# EasyEDA Pro project ProDoc_promicro_e22P_Tomas_2026-05-28.epro

# Schematic promicro_e22P_Tomas
Board Name: promicro_e22P_Tomas; Create Date: 2026-05-04; Page Name: Sheet_1; Project Name: promicro_e22P_30_2026-04-24_20-44-31; Schematic Name: promicro_e22P_Tomas; Update Date: 2026-05-04; Add into BOM: yes; Company: CNCnet; Convert to PCB: yes; Date: 2026-04-01; Draw By: Radek Vicek; REV: 1.0; Sheet: 1/1; spicePre: .
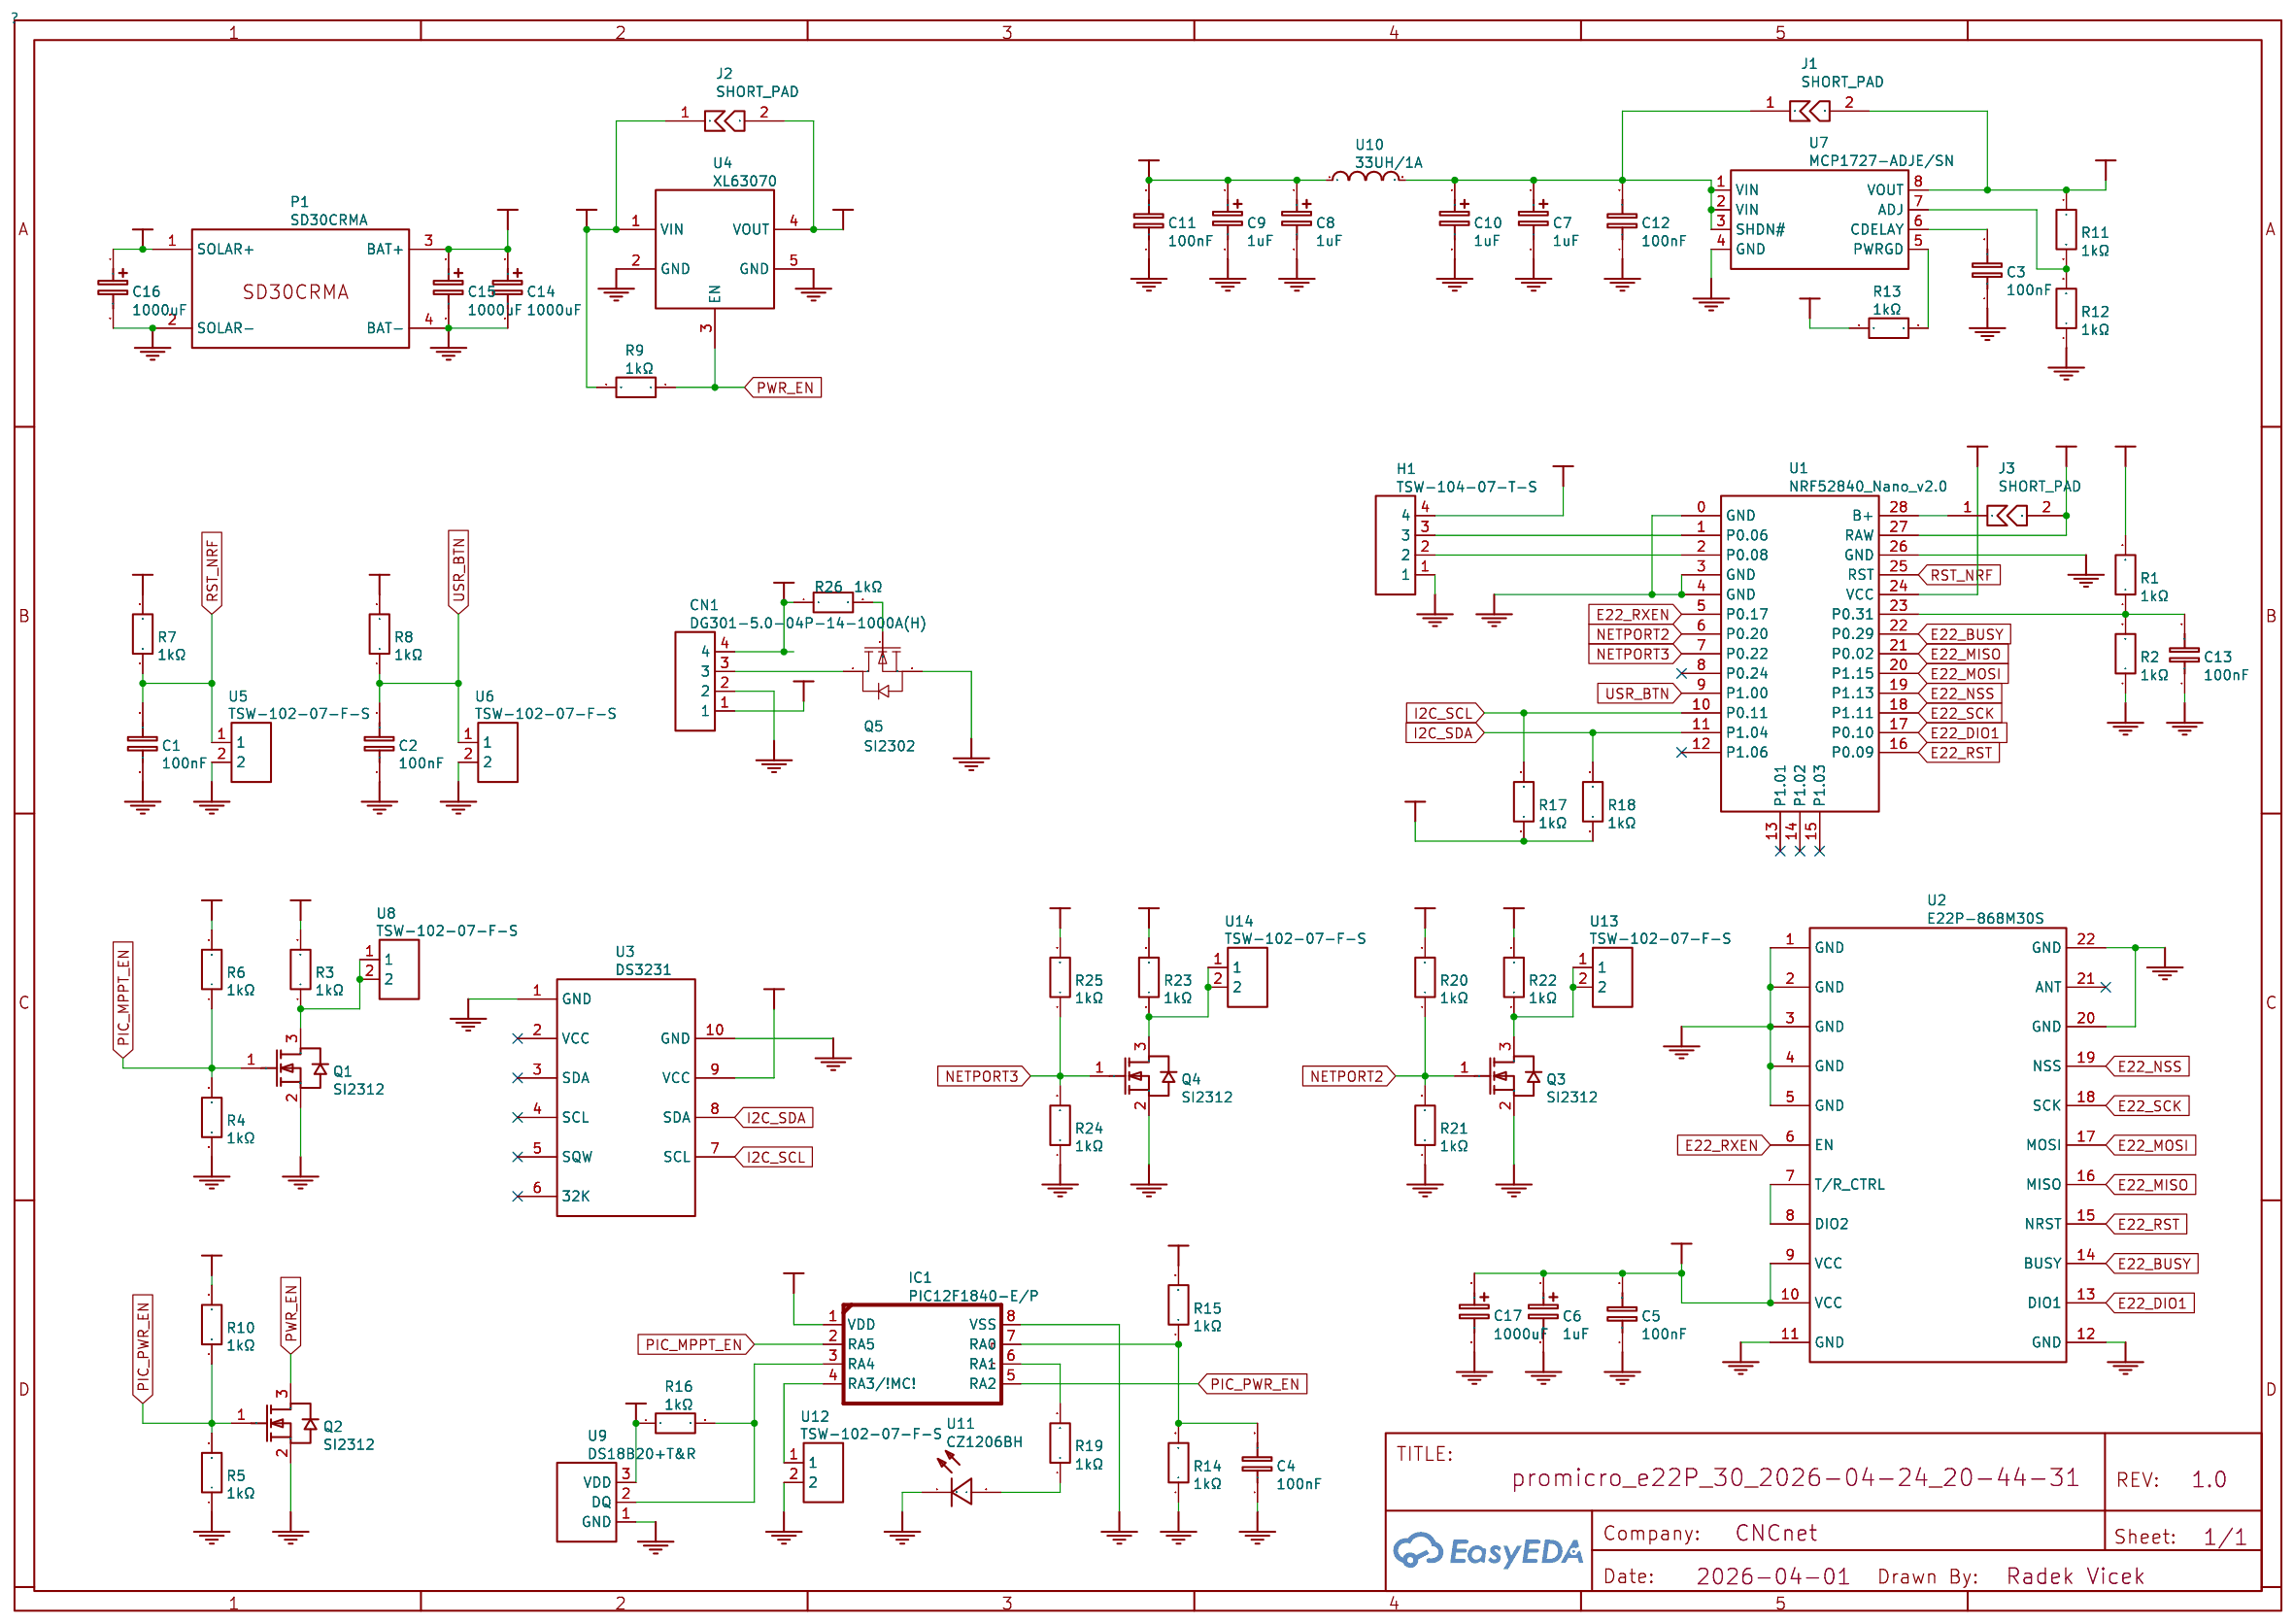
[diagram p0: schematic sheet]

## Parts
C1  100nF  [C1206]
C2  100nF  [C1206]
C3  100nF  [C1206]
C4  100nF  [C1206]
C5  100nF  [C1206]
C6  1uF  [CAP-SMD_L3.5-W2.8-R-RD]
C7  1uF  [CAP-SMD_L3.5-W2.8-R-RD]
C8  1uF  [CAP-SMD_L3.5-W2.8-R-RD]
C9  1uF  [CAP-SMD_L3.5-W2.8-R-RD]
C10  1uF  [CAP-SMD_L3.5-W2.8-R-RD]
C11  100nF  [C1206]
C12  100nF  [C1206]
C13  100nF  [C1206]
C14  1000uF  [CAP-D10.0×F5.0]
C15  1000uF  [CAP-D10.0×F5.0]
C16  1000uF  [CAP-D10.0×F5.0]
C17  1000uF  [CAP-D10.0×F5.0]
CN1  DG301-5.0-04P-14-1000A(H)  [CONN-TH_DEGSON_DG301-5.0-04P]
H1  TSW-104-07-T-S  [HDR-TH_4P-P2.54-V-M]
IC1  PIC12F1840-E/P  [DIL8-P]
J1  SHORT_PAD  [SHORT_PAD]
J2  SHORT_PAD  [SHORT_PAD]
J3  SHORT_PAD  [SHORT_PAD]
P1  SD30CRMA  [SD30CRMA]
Q1  SI2312  [SOT-23-3_L2.9-W1.3-P1.90-LS2.4-BR]
Q2  SI2312  [SOT-23-3_L2.9-W1.3-P1.90-LS2.4-BR]
Q3  SI2312  [SOT-23-3_L2.9-W1.3-P1.90-LS2.4-BR]
Q4  SI2312  [SOT-23-3_L2.9-W1.3-P1.90-LS2.4-BR]
Q5  SI2302  [SOT-23-3_L2.9-W1.3-P1.90-LS2.4-BR]
R1  1kΩ  [R1206]
R2  1kΩ  [R1206]
R3  1kΩ  [R1206]
R4  1kΩ  [R1206]
R5  1kΩ  [R1206]
R6  1kΩ  [R1206]
R7  1kΩ  [R1206]
R8  1kΩ  [R1206]
R9  1kΩ  [R1206]
R10  1kΩ  [R1206]
R11  1kΩ  [R1206]
R12  1kΩ  [R1206]
R13  1kΩ  [R1206]
R14  1kΩ  [R1206]
R15  1kΩ  [R1206]
R16  1kΩ  [R1206]
R17  1kΩ  [R1206]
R18  1kΩ  [R1206]
R19  1kΩ  [R1206]
R20  1kΩ  [R1206]
R21  1kΩ  [R1206]
R22  1kΩ  [R1206]
R23  1kΩ  [R1206]
R24  1kΩ  [R1206]
R25  1kΩ  [R1206]
R26  1kΩ  [R1206]
U1  NRF52840_Nano_v2.0  [NRF52840_NANO_V2,0]
U2  E22P-868M30S  [E22P-868M30S]
U3  DS3231  [DS3231]
U4  XL63070  [XL63070]
U5  TSW-102-07-F-S  [HDR-TH_2P-P2.54-V-M-3]
U6  TSW-102-07-F-S  [HDR-TH_2P-P2.54-V-M-3]
U7  MCP1727-ADJE/SN  [SOIC-8_L4.9-W3.9-P1.27-LS6.0-BL]
U8  TSW-102-07-F-S  [HDR-TH_2P-P2.54-V-M-3]
U9  DS18B20+T&R  [TO-92-3_L4.9-W3.7-P2.54-L]
U10  33UH/1A  [IND-TH_BD10.0-P5.00-D0.6]
U11  CZ1206BH  [LED-SMD_CZ1206BH]
U12  TSW-102-07-F-S  [HDR-TH_2P-P2.54-V-M-3]
U13  TSW-102-07-F-S  [HDR-TH_2P-P2.54-V-M-3]
U14  TSW-102-07-F-S  [HDR-TH_2P-P2.54-V-M-3]

## Library data of the parts
C1-C5 C11-C13 = CT41G-0805-2X1-50V-0.1uF-K(N): Capacitance:100nF Tolerance:±10% Tolerance:±10% Voltage Rating:50V Temperature Coefficient:-; LCSC Part Name: 100nF ±10% 50V; Supplier Part: C126469; Manufacturer: TORCH(火炬); Supplier Footprint: 0805; JLCPCB Part Class: Extended Part; Datasheet: https://item.szlcsc.com/datasheet/CT41G-0805-2X1-50V-0.1uF-K(N)/137749.html; Supplier: LCSC; Tolerance: ±10%; Voltage Rating: 50V
C6-C10 = TAJB105K035RNJ: Capacitance: Tolerance:±10% Tolerance:±10% Rated Voltage: Equivalent Series Resistance(ESR):6.5Ω@100kHz Operating Temperature:-55℃~+125℃ Operating Temperature:-55℃~+125℃; LCSC Part Name: 1uF ±10% 35V; Supplier Part: C7192; Manufacturer: Kyocera AVX; Supplier Footprint: CASE-B-3528-21(mm); JLCPCB Part Class: Extended Part; Datasheet: https://atta.szlcsc.com/upload/public/pdf/source/20160107/1457707750344.pdf; Supplier: LCSC; Tolerance: ±10%; Equivalent Series Resistance(ESR): 6.5Ω@100kHz; Operating Temperature: -55℃~+125℃
C14-C17 = PB25V1000M8X17: Capacitance:1000uF Tolerance:±20% Tolerance:±20% Voltage Rating:25V Ripple Current:4.5A@100kHz Equivalent Series Resistance(ESR):16mΩ@100kHz Type:Polymer Pin Spacing:3.5mm Diameter:8mm Height - Seated (Max):17mm Lifetime:5000hrs@105℃ Operating Temperature; LCSC Part Name: 1000uF ±20% 25V; Supplier Part: C51934175; Manufacturer: JIERR(捷而瑞); Supplier Footprint: 插件,D8xL17mm; JLCPCB Part Class: Extended Part; Datasheet: https://item.szlcsc.com/datasheet/PB25V1000M8X17/54649587.html; Supplier: LCSC; Tolerance: ±20%; Voltage Rating: 25V; Ripple Current: 4.5A@100kHz; Equivalent Series Resistance(ESR): 16mΩ@100kHz; Type: Polymer; Pin Spacing: 3.5mm; Diameter: 8mm; Height - Seated (Max): 17mm; Lifetime: 5000hrs@105℃; Operating Temperature: -55℃~+105℃
CN1 = DG301-5.0-04P-14-1000A(H): Supplier: LCSC; Supplier Part: C3037697; Manufacturer: DEGSON(高正/高松); JLCPCB Part Class: Extended Part; Contributor: lcsc; spicePre: C
H1 = TSW-104-07-T-S: Supplier: LCSC; Supplier Part: C7365925; Manufacturer: SAMTEC; JLCPCB Part Class: Extended Part; Contributor: lcsc; spicePre: H
IC1 = PIC12F1840-E/P: CPU Core:PIC CPU Maximum Speed:32MHz Core Size:8 Bit Program Storage Size:7KB Program Memory Type:FLASH RAM Size:256Byte EEPROM:256Byte Number of I/O:5 ADC (Bit):10bit DAC (Bit):5bit Oscillator Type:Built-in Voltage - Supply:2.3V~5.5V Voltage - Supply:2.3; LCSC Part Name: 采用XLP技术的8引脚闪存微控制器; Supplier Part: C640529; Manufacturer: MICROCHIP(美国微芯); Supplier Footprint: PDIP-8; JLCPCB Part Class: Extended Part; Datasheet: https://item.szlcsc.com/datasheet/PIC12F1840-E%252FP/670326.html; Supplier: LCSC; CPU Core: PIC; CPU Maximum Speed: 32MHz; Core Size: 8 Bit; Program Storage Size: 7KB; Program Memory Type: FLASH; RAM Size: 256Byte; EEPROM: 256Byte; Number of I/O: 5; ADC (Bit): 10bit; DAC (Bit): 5bit; Oscillator Type: Built-in; Voltage - Supply: 2.3V~5.5V; Operating Temperature: -40℃~+125℃
J1-J3 = SHORT_PAD: _: 3
P1 = SD30CRMA: Contributor: mrilic66; spicePre: P
Q1-Q4 = SI2312: Supplier: LCSC; Supplier Part: C351405; Manufacturer: PUOLOP(迪浦); JLCPCB Part Class: Extended Part; Contributor: LCSC; spicePre: Q
Q5 = SI2302_C20628873: Number:1 N-Channel Drain to Source Voltage:20V Current - Continuous Drain(Id):3.3A RDS(on):75mΩ@2.5V Pd - Power Dissipation:1W Gate Threshold Voltage (Vgs(th)):1.5V@250uA Type:N-Channel; LCSC Part Name: 1个N沟道 耐压:20V 电流:3.3A; Supplier Part: C20628873; Manufacturer: FOSAN(富捷/富信); Supplier Footprint: SOT-23; JLCPCB Part Class: Extended Part; Datasheet: https://item.szlcsc.com/datasheet/SI2302/22043121.html; Supplier: LCSC; Number: 1 N-Channel; Drain to Source Voltage: 20V; Current - Continuous Drain(Id): 3.3A; RDS(on): 75mΩ@2.5V; Pd - Power Dissipation: 1W; Gate Threshold Voltage (Vgs(th)): 1.5V@250uA; Type: N-Channel
R1-R26 = FRC0805J102 TS: Type:Thick Film Resistor Resistance:1kΩ Tolerance:±5% Tolerance:±5% Power(Watts):125mW Voltage-Supply(Max):150V Temperature Coefficient:±100ppm/℃ Temperature Coefficient:±100ppm/℃ Operating Temperature:-55℃~+155℃ Operating Temperature:-55℃~+155℃; LCSC Part Name: 1kΩ ±5% 125mW 厚膜电阻; Supplier Part: C2907295; Manufacturer: FOJAN(富捷); Supplier Footprint: 0805; JLCPCB Part Class: Extended Part; Supplier: LCSC; Type: Thick Film Resistor; Tolerance: ±5%; Power(Watts): 125mW; Voltage-Supply(Max): 150V; Temperature Coefficient: ±100ppm/℃; Operating Temperature: -55℃~+155℃
U1 = NRF52840_Nano_v2.0: Contributor: eugeniomercol; spicePre: U
U2 = E22P-868M30S: Supplier Part: C51912689; Manufacturer: EBYTE(亿佰特); Supplier Footprint: SMD,38.5x24mm; JLCPCB Part Class: Extended Part; Supplier: LCSC
U3 = DS3231: Manufacturer: IIOTSME; Supplier: IIOTSME; Contributor: mazran.iiotsme; spicePre: U
U4 = XL63070: Contributor: willyjestrabek; spicePre: U
U5 U6 U8 U12-U14 = TSW-102-07-F-S: Supplier: LCSC; Supplier Part: C3331037; Manufacturer: SAMTEC; JLCPCB Part Class: Extended Part; Contributor: lcsc; spicePre: U
U7 = MCP1727-ADJE/SN: Supplier: LCSC; Supplier Part: C635937; Manufacturer: MICROCHIP(美国微芯); JLCPCB Part Class: Extended Part; Contributor: LCSC; spicePre: U
U9 = DS18B20+T&R: Supplier: LCSC; Supplier Part: C880672; Manufacturer: ADI(亚德诺)/MAXIM(美信); JLCPCB Part Class: Extended Part; Contributor: LCSC; spicePre: U; spiceSymbolName: DS18B20+T&amp;R
U10 = 33UH/1A: Supplier: LCSC; Supplier Part: C9900019827; Manufacturer: null; Manufacturer Part: 33uH/1A; JLCPCB Part Class: Extended Part; Contributor: lcsc; spicePre: U
U11 = CZ1206BH: Supplier: LCSC; Supplier Part: C9900198175; Manufacturer: null; JLCPCB Part Class: Extended Part; Contributor: lcsc; spicePre: U

## Nets
+3V3: H1.4 R3.2 R6.2 R7.2 R8.2 R10.2 R17.1 R18.1 R20.2 R22.2 R23.2 R25.2 U1.24(VCC) U3.9(VCC)
+5V: C8.1 C9.1 C11.2 J2.2 U4.4(VOUT) U10.1
GND: C1.1 C2.1 C3.1 C4.1 C5.1 C6.2 C7.2 C8.2 C9.2 C10.2 C11.1 C12.1 C13.1 C14.2 C15.2 C16.2 C17.2 CN1.2 H1.1 IC1.8(VSS) P1.2(SOLAR-) P1.4(BAT-) Q1.2(S) Q2.2(S) Q3.2(S) Q4.2(S) Q5.2(S) R2.1 R4.1 R5.1 R12.1 R14.1 R21.1 R24.1 U1.0(GND) U1.3(GND) U1.4(GND) U1.26(GND) U2.1(GND) U2.2(GND) U2.3(GND) U2.4(GND) U2.5(GND) U2.11(GND) U2.12(GND) U2.20(GND) U2.22(GND) U3.1(GND) U3.10(GND) U4.2(GND) U4.5(GND) U5.2 U6.2 U7.4(GND) U9.1(GND) U11.1(C) U12.2
VBAT: C14.1 C15.1 CN1.4 IC1.1(VDD) J2.1 P1.3(BAT+) R1.2 R9.2 R15.2 R16.1 R26.1 U4.1(VIN) U9.3(VDD)
E22_BUSY: U1.22(P0.29) U2.14(BUSY)
E22_DIO1: U1.17(P0.10) U2.13(DIO1)
E22_MISO: U1.21(P0.02) U2.16(MISO)
E22_MOSI: U1.20(P1.15) U2.17(MOSI)
E22_NSS: U1.19(P1.13) U2.19(NSS)
E22_RST: U1.16(P0.09) U2.15(NRST)
E22_RXEN: U1.5(P0.17) U2.6(EN)
E22_SCK: U1.18(P1.11) U2.18(SCK)
I2C_SCL: R17.2 U1.10(P0.11) U3.7(SCL)
I2C_SDA: R18.2 U1.11(P1.04) U3.8(SDA)
NETPORT2: Q3.1(G) R20.1 R21.2 U1.6(P0.20)
NETPORT3: Q4.1(G) R24.2 R25.1 U1.7(P0.22)
PIC_MPPT_EN: IC1.2(RA5) Q1.1(G) R4.2 R6.1
PIC_PWR_EN: IC1.5(RA2) Q2.1(G) R5.2 R10.1
PWR_EN: Q2.3(D) R9.1 U4.3(EN)
RST_NRF: C1.2 R7.1 U1.25(RST) U5.1
USR_BTN: C2.2 R8.1 U1.9(P1.00) U6.1
VRAW: C5.2 C6.1 C17.1 J1.2 J3.2 R11.1 R13.2 U1.27(RAW) U2.9(VCC) U2.10(VCC) U7.8(VOUT)
VSOL: C16.1 CN1.1 P1.1(SOLAR+)
$1N10: U2.7(T/R CTRL) U2.8(DIO2)
$1N12: C13.2 R1.1 R2.2 U1.23(P0.31)
$1N32: Q1.3(D) R3.1 U8.1 U8.2
$1N33: R13.1 U7.5(PWRGD)
$1N35: C3.2 U7.6(CDELAY)
$1N37: R11.2 R12.2 U7.7(ADJ)
$1N43: IC1.3(RA4) R16.2 U9.2(DQ)
$1N45: C4.2 IC1.7(RA0) R14.2 R15.1
$1N53: C7.1 C10.1 C12.2 J1.1 U7.1(VIN) U7.2(VIN) U7.3(SHDN#) U10.2
$1N58: H1.3 U1.1(P0.06)
$1N62: H1.2 U1.2(P0.08)
$1N68: R19.1 U11.2(A)
$1N69: IC1.6(RA1) R19.2
$1N72: IC1.4(RA3/!MC!) U12.1
$1N75: Q3.3(D) R22.1 U13.1 U13.2
$1N84: Q4.3(D) R23.1 U14.1 U14.2
$1N86: J3.1 U1.28(B+)
$1N3345: CN1.3 Q5.3(D)
$1N3704: Q5.1(G) R26.2

Not connected (* = marked no-connect by the designer): U1 8(P0.24)* 12(P1.06)* 13(P1.01)* 14(P1.02)* 15(P1.03)*; U2 21(ANT)*; U3 2(VCC)* 3(SDA)* 4(SCL)* 5(SQW)* 6(32K)*

# Board PCB_promicro_e22P_30_Tomas
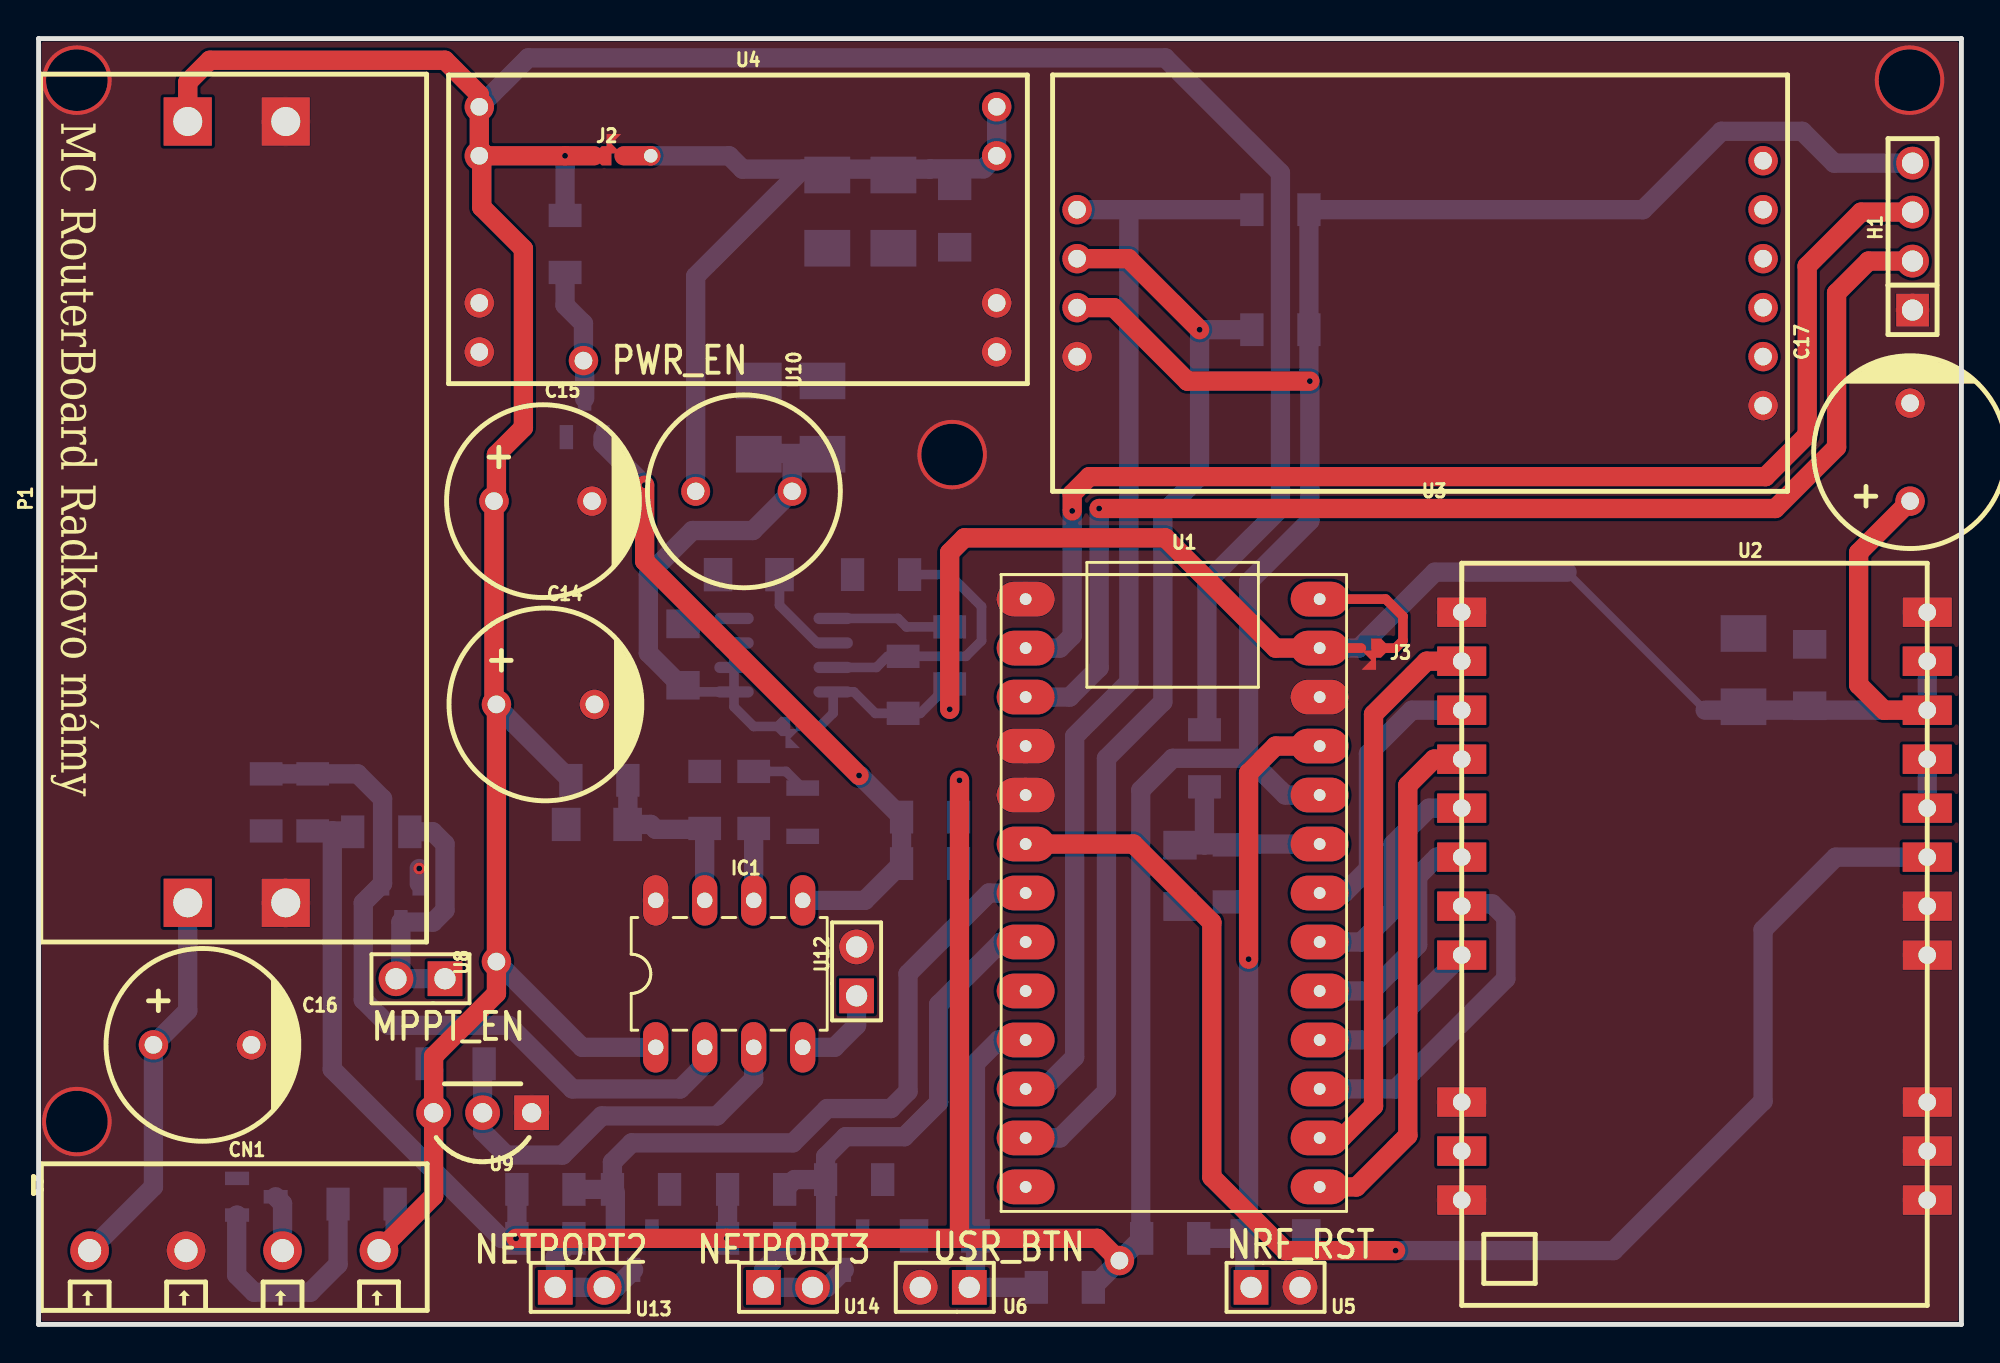
[diagram p1: board, top side]
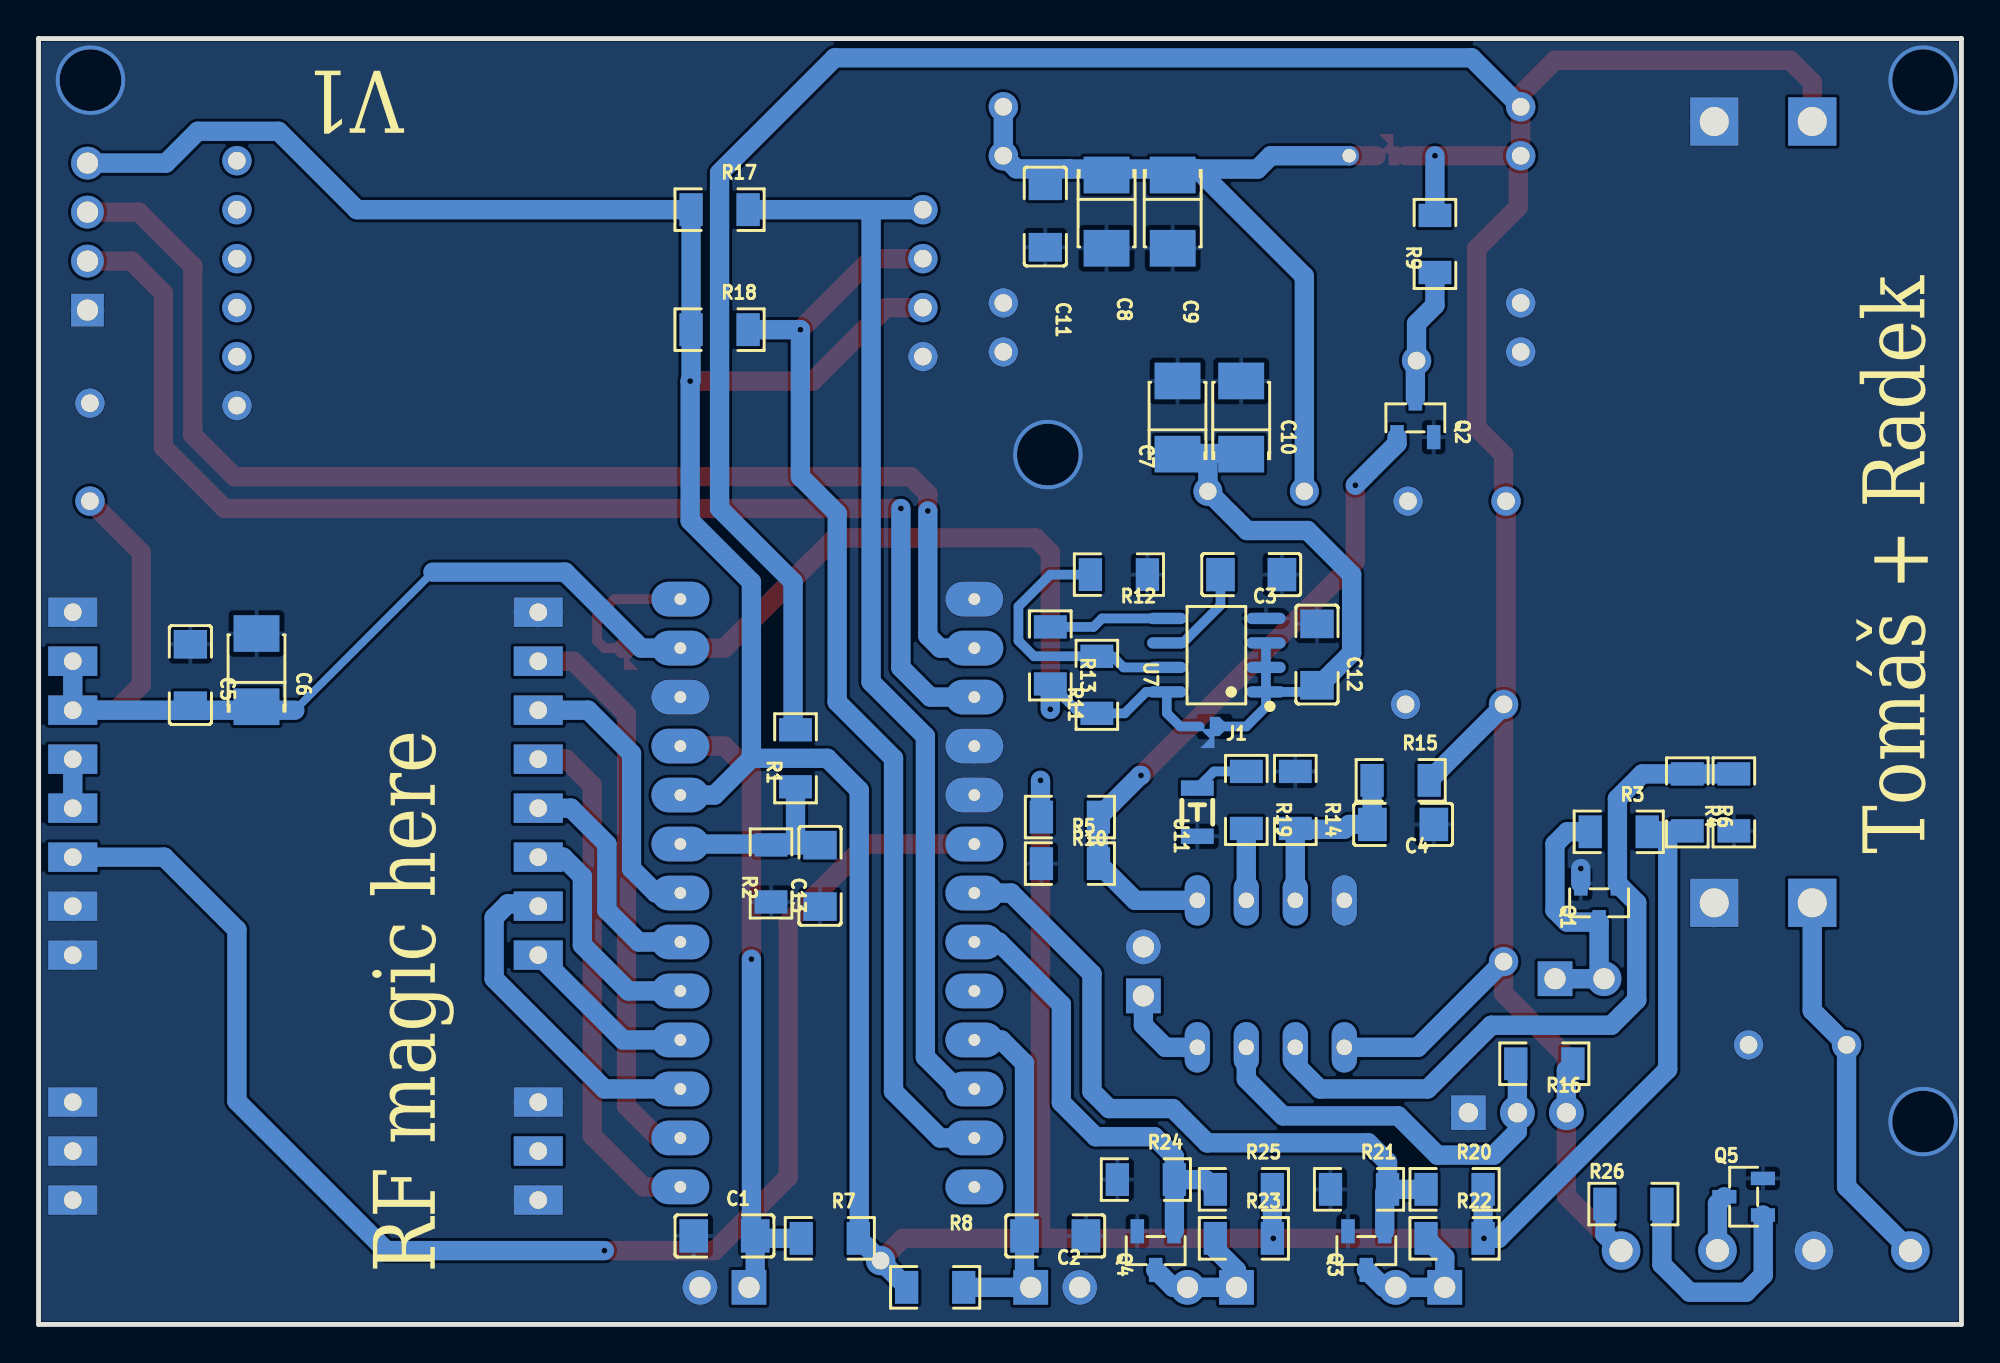
[diagram p2: board, bottom side, seen from below]

Outline 99.67 x 66.67 mm; copper layers: Top Layer, Bottom Layer. Coordinates in mm from the lower left corner of the outline.
Outline path: 0,66.67 99.67,66.67 99.67,0 0,0 0,66.67
Stack: Top Layer 0.035mm / Dielectric1 1.51mm FR4 er 4.5 / Bottom Layer 0.035mm

## Design rules (mm)
spacing Default (default): track to track 0.152, other pairs 0 to 0.152
track width Default (default): min 0.254, default 0.254, max 25.4
differential pair differentialPair (default): width min 0.127, default 0.254, max 2.54; gap min 0.152, default 0.152
via Default (default): diameter min 0.61, default 0.61, max 100.025; hole min 0.305, default 0.305, max 59.995

## Placement (name value [footprint] x y rotation side)
C1  100nF  [C1206]  64.12 4.59 180 bottom
C2  100nF  [C1206]  46.98 4.59 0 bottom
C3  100nF  [C1206]  36.82 38.88 0 bottom
C4  100nF  [C1206]  28.94 25.93 0 bottom
C5  100nF  [C1206]  91.81 33.67 270 bottom
C6  1uF  [CAP-SMD_L3.5-W2.8-R-RD]  88.38 33.93 270 bottom
C7  1uF  [CAP-SMD_L3.5-W2.8-R-RD]  40.64 47.02 270 bottom
C8  1uF  [CAP-SMD_L3.5-W2.8-R-RD]  44.31 57.7 90 bottom
C9  1uF  [CAP-SMD_L3.5-W2.8-R-RD]  40.88 57.7 90 bottom
C10  1uF  [CAP-SMD_L3.5-W2.8-R-RD]  37.33 47.02 270 bottom
C11  100nF  [C1206]  47.49 57.45 90 bottom
C12  100nF  [C1206]  33.41 34.73 270 bottom
C13  100nF  [C1206]  59.17 23.26 90 bottom
C14  1000uF  [CAP-D10.0×F5.0]  26.27 32.15 0 top
C15  1000uF  [CAP-D10.0×F5.0]  26.15 42.69 0 top
C16  1000uF  [CAP-D10.0×F5.0]  8.49 14.5 0 top
C17  1000uF  [CAP-D10.0×F5.0]  97.01 45.23 90 top
CN1  DG301-5.0-04P-14-1000A(H)  [CONN-TH_DEGSON_DG301-5.0-04P]  10.14 3.83 0 top
H1  TSW-104-07-T-S  [HDR-TH_4P-P2.54-V-M]  97.14 56.41 90 top
IC1  PIC12F1840-E/P  [DIL8-P]  35.8 18.18 0 top
J1  -  [SHORT_PAD]  38.47 31.01 0 bottom
J2  -  [SHORT_PAD]  29.2 60.6 0 top
J3  -  [SHORT_PAD]  69.58 35.07 180 top
NOREF  -  [Pad_e1408]  31.73 60.6 0 top
NOREF#2  -  [Pad_e644]  23.73 18.81 0 top
NOREF#3  -  [Pad_e922]  56.03 3.31 0 top
P1  -  [SD30CRMA]  0.11 19.83 90 top
Q1  SI2312  [SOT-23-3_L2.9-W1.3-P1.90-LS2.4-BR]  18.78 21.86 90 bottom
Q2  SI2312  [SOT-23-3_L2.9-W1.3-P1.90-LS2.4-BR]  28.31 47.01 270 bottom
Q3  SI2312  [SOT-23-3_L2.9-W1.3-P1.90-LS2.4-BR]  30.85 3.83 90 bottom
Q4  SI2312  [SOT-23-3_L2.9-W1.3-P1.90-LS2.4-BR]  41.77 3.83 90 bottom
Q5  SI2302  [SOT-23-3_L2.9-W1.3-P1.90-LS2.4-BR]  11.29 6.62 180 bottom
R1  1kΩ  [R1206]  60.44 29.36 90 bottom
R2  1kΩ  [R1206]  61.71 23.39 90 bottom
R3  1kΩ  [R1206]  17.77 25.55 180 bottom
R4  1kΩ  [R1206]  11.8 27.07 90 bottom
R5  1kΩ  [R1206]  46.21 23.89 180 bottom
R6  1kΩ  [R1206]  14.21 27.07 270 bottom
R7  1kΩ  [R1206]  58.66 4.46 180 bottom
R8  1kΩ  [R1206]  53.2 1.92 0 bottom
R9  1kΩ  [R1206]  27.29 56.03 90 bottom
R10  1kΩ  [R1206]  46.21 26.31 0 bottom
R11  1kΩ  [R1206]  44.82 33.17 90 bottom
R12  1kΩ  [R1206]  43.67 38.88 0 bottom
R13  1kΩ  [R1206]  47.23 34.69 270 bottom
R14  1kΩ  [R1206]  34.53 27.2 270 bottom
R15  1kΩ  [R1206]  29.07 28.21 180 bottom
R16  1kΩ  [R1206]  21.62 13.52 0 bottom
R17  1kΩ  [R1206]  64.37 57.8 180 bottom
R18  1kΩ  [R1206]  64.37 51.58 180 bottom
R19  1kΩ  [R1206]  37.07 27.2 270 bottom
R20  1kΩ  [R1206]  26.27 7 180 bottom
R21  1kΩ  [R1206]  31.23 7 180 bottom
R22  1kΩ  [R1206]  26.27 4.46 180 bottom
R23  1kΩ  [R1206]  37.2 4.46 180 bottom
R24  1kΩ  [R1206]  42.28 7.51 180 bottom
R25  1kΩ  [R1206]  37.2 7 180 bottom
R26  1kΩ  [R1206]  17 6.24 180 bottom
U1  NRF52840_Nano_v2.0  [NRF52840_NANO_V2,0]  50.02 5.86 0 top
U2  -  [E22P-868M30S]  85.84 21.69 0 top
U3  -  [DS3231]  88.12 48.91 180 top
U4  -  [XL63070]  22.84 63.14 0 top
U5  TSW-102-07-F-S  [HDR-TH_2P-P2.54-V-M-3]  64.12 1.92 0 top
U6  TSW-102-07-F-S  [HDR-TH_2P-P2.54-V-M-3]  46.98 1.92 180 top
U7  MCP1727-ADJE/SN  [SOIC-8_L4.9-W3.9-P1.27-LS6.0-BL]  38.62 34.7 90 bottom
U8  TSW-102-07-F-S  [HDR-TH_2P-P2.54-V-M-3]  19.8 17.92 180 top
U9  DS18B20+T&R  [TO-92-3_L4.9-W3.7-P2.54-L]  23.02 10.98 180 top
U10  33UH/1A  [IND-TH_BD10.0-P5.00-D0.6]  36.56 43.2 0 top
U11  CZ1206BH  [LED-SMD_CZ1206BH]  39.61 26.56 90 bottom
U12  TSW-102-07-F-S  [HDR-TH_2P-P2.54-V-M-3]  42.4 18.31 90 top
U13  TSW-102-07-F-S  [HDR-TH_2P-P2.54-V-M-3]  28.05 1.92 0 top
U14  TSW-102-07-F-S  [HDR-TH_2P-P2.54-V-M-3]  38.85 1.92 0 top

## Footprints (pads in the part's own frame, mm; a bottom-side part is the same pattern mirrored in y, then rotated)
C1206
  rect 1.485x1.728 smd: 1(-1.593,0) 2(1.593,0)
CAP-D10.0×F5.0
  round 1.524 hole 0.914: 1(-2.54,0) 2(2.54,0)
CAP-SMD_L3.5-W2.8-R-RD
  rect 1.9x2.376 smd: 1(1.899,0) 2(-1.899,0)
CONN-TH_DEGSON_DG301-5.0-04P
  round 2 hole 1.2: 1(-7.5,0) 2(-2.5,0) 3(2.5,0) 4(7.5,0)
DIL8-P
  oval 1.308x2.616 hole 0.8x0.805: 1(-3.81,-3.81) 2(-1.27,-3.81) 3(1.27,-3.81) 4(3.81,-3.81) 5(3.81,3.81) 6(1.27,3.81) 7(-1.27,3.81) 8(-3.81,3.81)
DS3231
  round 1.524 hole 0.914: 1(-1.27,1.27) 2(-1.27,-1.27) 3(-1.27,-3.81) 4(-1.27,-6.35) 5(-1.27,-8.89) 6(-1.27,-11.43) 7(34.29,-8.89) 8(34.29,-6.35) 9(34.29,-3.81) 10(34.29,-1.27)
E22P-868M30S
  rect 2.54x1.524 hole 0.914: 1(12.065,-15.24) 2(12.065,-12.7) 3(12.065,-10.16) 4(12.065,-2.54) 5(12.065,0) 6(12.065,2.54) 7(12.065,5.08) 8(12.065,7.62) 9(12.065,10.16) 10(12.065,12.7) 11(12.065,15.24) 12(-12.065,15.24) 13(-12.065,12.7) 14(-12.065,10.16) 15(-12.065,7.62) 16(-12.065,5.08) 17(-12.065,2.54) 18(-12.065,0) 19(-12.065,-2.54) 20(-12.065,-10.16) 21(-12.065,-12.7) 22(-12.065,-15.24)
HDR-TH_2P-P2.54-V-M-3
  rect 1.8x1.8 hole 1.1: 1(-1.27,0)
  round 1.8 hole 1.1: 2(1.27,0)
HDR-TH_4P-P2.54-V-M
  rect 1.7x1.7 hole 1.1: 1(-3.81,0)
  round 1.7 hole 1.1: 2(-1.27,0) 3(1.27,0) 4(3.81,0)
IND-TH_BD10.0-P5.00-D0.6
  round 1.5 hole 0.9: 1(-2.5,0) 2(2.5,0)
LED-SMD_CZ1206BH
  rect 0.8x1.7 smd: 1(-1.25,0) 2(1.25,0)
NRF52840_NANO_V2,0
  oval 3x1.8 hole 0.61: 0(1.143,31.75) 1(1.143,29.21) 2(1.143,26.67) 3(1.143,24.13) 4(1.143,21.59) 5(1.143,19.05) 6(1.143,16.51) 7(1.143,13.97) 8(1.143,11.43) 9(1.143,8.89) 10(1.143,6.35) 11(1.143,3.81) 12(1.143,1.27) 16(16.383,1.27) 17(16.383,3.81) 18(16.383,6.35) 19(16.383,8.89) 20(16.383,11.43) 21(16.383,13.97) 22(16.383,16.51) 23(16.383,19.05) 24(16.383,21.59) 25(16.383,24.13) 26(16.383,26.67) 27(16.383,29.21) 28(16.383,31.75)
Pad_e644
  round 1.524 hole 0.914: 1(0,0)
Pad_e922
  round 1.524 hole 0.914: 1(0,0)
Pad_e1408
  round 1 hole 0.7: 1(0,0)
R1206
  rect 1.208x1.701 smd: 1(-1.479,0) 2(1.479,0)
SD30CRMA
  rect 2.5x2.5 hole 1.5x1.5: 1(2.032,-7.62) 2(2.032,-12.7) 3(42.545,-7.62) 4(42.544,-12.7)
SHORT_PAD
  custom 1x1 smd: 1(0,0)
  custom 0.75x1 smd: 2(0.625,0.312)
SOIC-8_L4.9-W3.9-P1.27-LS6.0-BL
  oval 0.588x2.045 smd: 1(-1.905,-2.57) 2(-0.635,-2.57) 3(0.635,-2.57) 4(1.905,-2.57) 5(1.905,2.57) 6(0.635,2.57) 7(-0.635,2.57) 8(-1.905,2.57)
SOT-23-3_L2.9-W1.3-P1.90-LS2.4-BR
  rect 1.25x0.7 smd: 1(1,-0.95) 2(1,0.95) 3(-1,0)
TO-92-3_L4.9-W3.7-P2.54-L
  rect 1.8x1.8 hole 1: 1(-2.54,0)
  round 1.8 hole 1: 2(0,0) 3(2.54,0)
XL63070
  round 1.524 hole 0.914: 1(0,0) 1(0,-2.54) 2(0,-10.17) 2(0,-12.71) 3(5.4,-13.16) 4(26.82,0) 4(26.82,-2.54) 5(26.82,-10.17) 5(26.82,-12.71)

## Nets
As in the schematic, except:
+3V3: H1.4 NOREF#3.1 R3.2 R6.2 R7.2 R8.2 R10.2 R17.1 R18.1 R20.2 R22.2 R23.2 R25.2 U1.24 U3.9
+5V: C8.1 C9.1 C11.2 J2.2 NOREF.1 U4.4 U10.1
VBAT: C14.1 C15.1 CN1.4 IC1.1 J2.1 NOREF#2.1 P1.3 R1.2 R9.2 R15.2 R16.1 R26.1 U4.1 U9.3

Pads without a net: U1 8 12; U2 21; U3 2 3 4 5 6

## Via types
v1: diameter 0.61, hole 0.305, Top Layer to Bottom Layer, 14 vias
v2: diameter 3.6, hole 3.2, Top Layer to Bottom Layer, 4 vias

## Routing (per net, layer and track width the routed paths; a pad name or vN(x,y) marks a point on that pad's centre or on a via; arc(x,y) is an arc through that point)
+3V3: length 204.8
  Top Layer w1: NOREF#3.1 54.88,4.46 v1(35.67,4.46) v1(24.75,4.46) ; v1(47.74,28.21) 47.74,4.47 ; U3.9 55.74,52.72 59.55,48.91 v1(65.9,48.91)
  Bottom Layer w1: 62.72,29.36 62.72,38.5 65.9,41.67 v1(65.9,48.91) 65.85,48.96 R18.1 R17.1 83.17,57.8 87.23,61.87 91.42,61.87 93.08,60.22 H1.4 ; 62.72,29.36 58.79,29.36 57.14,27.7 57.14,4.51 R7.2 NOREF#3.1 54.68,1.96 R8.2 ; 62.72,29.36 64.63,27.45 66.41,27.45 ; 15.22,25.59 15.22,13.23 23.99,4.46 R22.2 R20.2 ; 15.22,25.59 16.24,25.59 R3.2 ; 15.22,25.59 R6.2 ; v1(47.74,28.21) 47.74,26.35 R10.2 ; R25.2 R23.2
+5V: length 41.4
  Top Layer w1: NOREF.1 30.35,60.6
  Bottom Layer w1: 39.61,59.91 46.2,59.91 46.22,59.92 48.99,59.92 U4.4 U4.4 ; 39.61,59.91 34.06,54.35 U10.1 ; 39.61,59.91 36.49,59.91 35.8,60.6 NOREF.1
GND: length 0.8
  Bottom Layer w1: Q1.2 v1(19.73,23.64)
  vias: v2(1.98,64.52) v2(1.98,10.52) v2(47.36,45.1) v2(96.98,64.52)
VBAT: length 188.1
  Top Layer w1: 28.79,60.6 v1(27.29,60.6) U4.1 ; U4.1 22.97,60.47 22.97,57.93 25.13,55.77 25.13,46.5 23.73,45.1 23.73,42.82 C15.1 23.61,32.28 C14.1 NOREF#2.1 23.73,17.16 20.48,13.91 U9.3 20.48,6.66 CN1.4 ; U4.1 U4.1 22.84,63.77 21.07,65.55 8.88,65.55 7.73,64.41 P1.3
  Bottom Layer w1: U9.3 20.48,13.18 R16.1 ; CN1.4 18.48,4.66 R26.1 ; C14.1 23.73,32.07 R15.2 ; R1.2 60.56,30.96 60.56,38.5 64.37,42.31 64.37,59.71 58.4,65.68 25.39,65.68 U4.1 ; R9.2 v1(27.29,60.6) ; NOREF#2.1 28.18,14.37 IC1.1
E22_BUSY: length 14.8
  Bottom Layer w1: U2.14 71.19,31.85 68.94,29.6 68.94,23.63 67.68,22.37 66.41,22.37
E22_DIO1: length 29.5
  Top Layer w1: 66.41,9.67 67.55,9.67 69.2,11.32 69.2,31.64 71.95,34.39 U2.13
E22_MISO: length 12.2
  Bottom Layer w1: U2.16 72.08,26.77 70.22,24.91 70.22,21.48 68.57,19.83 66.41,19.83
E22_MOSI: length 12.3
  Bottom Layer w1: 66.41,17.29 69.1,17.29 71.49,19.67 71.49,23.23 72.49,24.23 U2.17
E22_NSS: length 9.2
  Bottom Layer w1: U2.19 69.37,14.75 66.41,14.75
E22_RST: length 27.2
  Top Layer w1: U2.15 72.33,29.31 70.98,27.96 70.98,9.8 68.31,7.13 66.41,7.13
E22_RXEN: length 76.9
  Top Layer w1: U1.5 56.75,24.91 60.82,20.85 60.82,7.64 64.63,3.83 v1(70.34,3.83)
  Bottom Layer w1: U2.6 93.16,24.23 89.39,20.47 89.39,11.57 81.65,3.83 v1(70.34,3.83)
E22_SCK: length 17.8
  Bottom Layer w1: U2.18 73.89,21.81 75.35,21.81 76.06,21.1 76.06,17.92 70.34,12.21 66.41,12.21
I2C_SCL: length 57.3
  Bottom Layer w1: U1.10 52.05,12.21 53.71,13.86 53.71,30.5 56.52,33.31 56.52,57.75 ; R17.2 U3.7
I2C_SDA: length 57.3
  Top Layer w1: U3.8 56.5,55.26 v1(60.18,51.58)
  Bottom Layer w1: U1.11 52.94,9.67 55.36,12.08 55.36,29.36 58.28,32.28 58.28,42.06 60.18,43.96 v1(60.18,51.58) R18.2
NETPORT2: length 36.2
  Bottom Layer w1: Q3.1 29.9,6.85 ; R20.1 29.75,7 29.75,8.42 30.75,9.42 39.1,9.42 40.88,11.19 44.18,11.19 45.07,12.08 45.07,18.18 49.26,22.37 U1.6
NETPORT3: length 24.1
  Bottom Layer w1: R24.2 40.8,8.7 41.83,9.73 44.88,9.73 46.66,11.51 46.66,16.59 49.9,19.83 U1.7 ; R24.2 40.8,4.85 ; R24.2 39.18,7.51 R25.1
PIC_MPPT_EN: length 38.4
  Bottom Layer w1: R4.2 R6.1 16.54,28.55 17.83,27.26 Q1.1 16.83,21.86 16.83,16.83 18.15,15.51 24.37,15.51 27.67,12.21 33.26,12.21 34.53,13.48 IC1.2
PIC_PWR_EN: length 34.5
  Top Layer w1: v1(31.42,43.52) 31.42,39.58 v1(42.53,28.47)
  Bottom Layer w1: IC1.5 42.83,21.99 R5.2 R10.1 42.58,28.47 v1(42.53,28.47) ; v1(31.42,43.52) 29.26,45.68 Q2.1
PWR_EN: length 7
  Bottom Layer w1: Q2.3 28.31,49.92 U4.3 28.24,51.89 27.29,52.85 R9.1
RST_NRF: length 33.6
  Top Layer w1: v1(62.72,18.94) 62.72,28.59 64.12,29.99 66.41,29.99
  Bottom Layer w1: U5.1 62.53,2.25 C1.2 ; C1.2 62.72,4.79 v1(62.72,18.94) ; C1.2 62.4,4.46 60.14,4.46
USR_BTN: length 18.3
  Bottom Layer w1: R8.1 U6.1 48.57,2.25 C2.2 48.57,13.55 49.77,14.75 U1.9
VRAW: length 97
  Top Layer w0.5: 66.41,35.07 68.57,35.07
  Top Layer w1: 66.41,35.07 64.12,35.07 58.4,40.78 47.99,40.78 47.23,40.02 v1(47.23,31.89) ; C17.1 94.35,40.02 94.35,33.17 95.66,31.85 U2.9
  Bottom Layer w0.4: 86.39,31.85 79.23,39.01
  Bottom Layer w0.5: R13.2 45.7,31.69 R11.1 43.37,31.69 42.26,32.8 U7.8 41.19,31.7 40.5,31.01 39.48,31.01
  Bottom Layer w1: v1(47.23,31.89) R13.2 ; 79.23,39.01 72.37,39.01 68.44,35.07 66.41,35.07 ; U2.10 U2.9 86.39,31.85
VSOL: length 20.1
  Bottom Layer w1: CN1.1 5.95,7.14 C16.1 7.73,16.27 P1.1
$1N10: length 2.5
  Bottom Layer w1: U2.8 U2.7
$1N12: length 10.3
  Bottom Layer w1: C13.2 59.18,24.86 60.43,24.86 ; 60.43,24.86 60.44,24.87 R1.1 ; 60.43,24.86 R2.2 61.75,24.91 66.41,24.91
$1N32: length 13.6
  Bottom Layer w1: R3.1 20.43,25.55 21.07,24.91 21.07,21.48 20.45,20.86 Q1.3 18.78,18.18 U8.2 U8.1
$1N33: length 6.2
  Bottom Layer w0.5: R13.1 44.99,36.17 44.55,36.61 U7.5
$1N35: length 5.2
  Bottom Layer w0.5: C3.2 38.41,37.29 40.36,35.34 U7.6
$1N37: length 14.5
  Bottom Layer w0.5: U7.7 43.43,34.07 44.01,34.64 R11.2 48.07,34.64 48.88,35.45 48.88,37.23 47.23,38.88 R12.2
$1N43: length 21.4
  Bottom Layer w1: R16.2 23.02,13.44 U9.2 23.02,10.01 24.24,8.78 27.16,8.78 29.2,10.81 35.16,10.81 37.07,12.72 IC1.3
$1N45: length 10.1
  Bottom Layer w1: R15.1 30.55,25.94 C4.2 31.73,25.93 31.99,25.67 34.48,25.67 R14.2 IC1.7
$1N53: length 29.8
  Bottom Layer w0.5: U7.3 U7.2 U7.1 ; U7.1 36.05,32.03 37.07,31.01 38.31,31.01 ; U7.1 33.75,32.8 C12.2
  Bottom Layer w1: 39.06,45.15 U10.2 37.03,41.17 33.89,41.17 31.61,38.88 31.61,34.82 33.28,33.14 C12.2 ; 37.33,45.16 40.64,45.16
$1N58: length 64.8
  Top Layer w1: H1.3 94.47,57.68 91.68,54.88 91.68,46.12 89.52,43.96 54.47,43.96 53.58,43.07 v1(53.58,42.18)
  Bottom Layer w1: v1(53.58,42.18) 53.58,35.7 52.94,35.07 U1.1
$1N62: length 64.9
  Top Layer w1: v1(54.98,42.31) 90.03,42.31 93.2,45.48 93.2,53.48 94.85,55.14 H1.2
  Bottom Layer w1: v1(54.98,42.31) 54.98,34.05 53.45,32.53 U1.2
$1N68: length 2.9
  Bottom Layer w0.5: R19.1 38.74,28.67 U11.2
$1N69: length 3.7
  Bottom Layer w1: R19.2 IC1.6
$1N72: length 4.8
  Bottom Layer w1: U12.1 42.4,15.51 41.26,14.37 IC1.4
$1N75: length 7.4
  Bottom Layer w1: R22.1 26.78,3.49 26.78,1.92 29.94,1.92 Q3.3
$1N84: length 7.6
  Bottom Layer w1: R23.1 38.67,3.91 37.58,2.81 U14.1 U14.2 40.86,1.92 Q4.3
$1N86: length 7.1
  Top Layer w0.5: 69.73,35.07 70.34,35.07 70.72,35.45 70.72,36.72 69.83,37.61 66.41,37.61
$1N3345: length 2.9
  Bottom Layer w1: CN1.3 12.64,6.27 Q5.3
$1N3704: length 12.5
  Bottom Layer w1: R26.2 15.52,3.11 14.08,1.67 11.16,1.67 10.27,2.56 10.27,5.66 Q5.1

## Copper pours and planes (outline as drawn; the poured copper is in the pictures)
GND on Top Layer: -1.54,68.22 101.08,68.22 101.08,-1.51 -1.54,-1.51
GND on Bottom Layer: -2.81,69.36 102.47,69.36 102.47,-2.65 -2.81,-2.65

## Text on the board
Bottom Silkscreen Layer: Tomáš + Radek | RF magic here | V1
Top Silkscreen Layer: MPPT_EN | NETPORT2 | PWR_EN | NETPORT3 | USR_BTN | NRF_RST | MC RouterBoard Radkovo mámy
